# Altium schematic sheet UNG8077_EVB_7801-9031_A_1-Title.SchDoc
size 416 x 264 mm; SheetNumber: 1; PageTitle: Title; PageSetup: Record=PageOptions|CenterHorizontal=True|CenterVertical=True|PrintScale=1.02|XCorrection=1.00|YCorrection=1.00|PrintKind=0|BorderSize=5000000|LeftOffset=0|BottomOffset=0|Orientation=2|PaperLength=1000|PaperWidth=1000|Scale=100|PaperSource=7|PrintQuality=-3|MediaType=1|DitherType=10|PrintScaleMode=1|PaperKind=11 x 17|PaperIndex=119; DocumentFullPathAndName: //depot_np_hweng_boards/ung_hweng/UNG_8077_LAN7801-KSZ9031_DemoEVB/A/
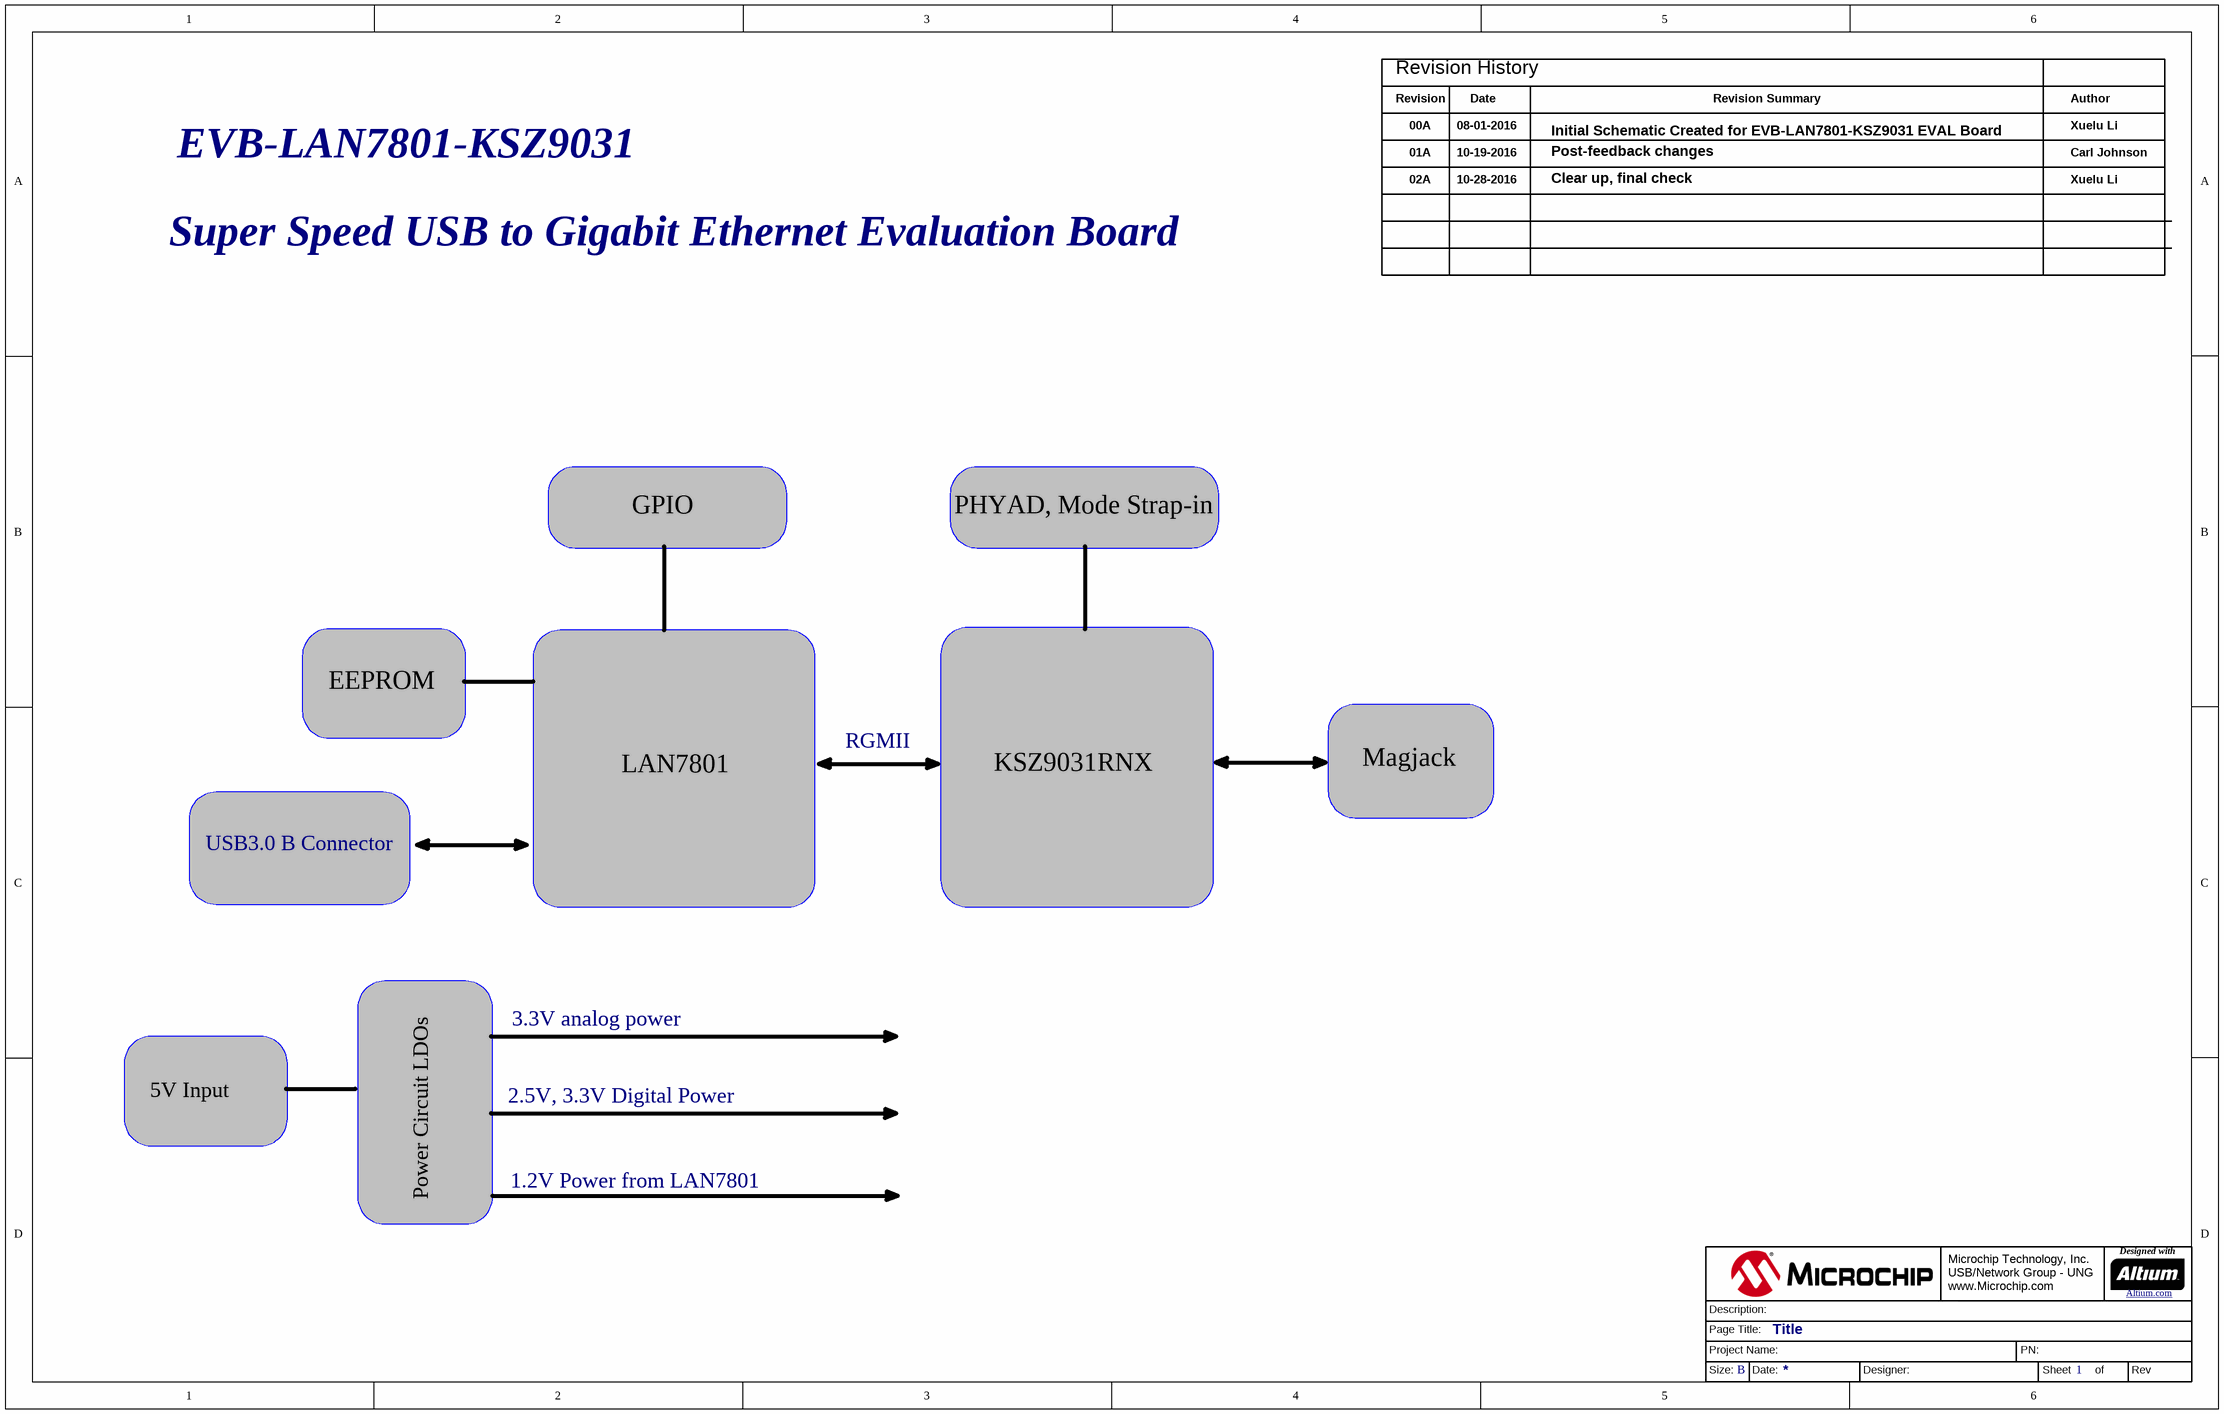
[diagram p0: UNG8077_EVB_7801-9031_A_1-Title.SchDoc]

## Parts
?  (no value)  (graphical)

## Notes on the sheet
- Revision History
- Revision
- 00A
- 08-01-2016
- Date
- Initial Schematic Created for EVB-LAN7801-KSZ9031 EVAL Board
- Revision Summary
- Author
- Xuelu Li
- EVB-LAN7801-KSZ9031
- 01A
- 02A
- 10-19-2016
- 10-28-2016
- Post-feedback changes
- Clear up, final check
- Carl Johnson
- Super Speed USB to Gigabit Ethernet Evaluation Board
- GPIO
- PHYAD, Mode Strap-in
- EEPROM
- RGMII
- LAN7801
- KSZ9031RNX
- Magjack
- USB3.0 B Connector
- 3.3V analog power
- 5V Input
- 2.5V, 3.3V Digital Power
- Power Circuit LDOs
- 1.2V Power from LAN7801
- Microchip Technology, Inc.
  USB/Network Group - UNG
  www.Microchip.com
- Designed with
- Altium.com <http://go.altium.com/MicrochipLandingPage_Evaluation.html>
- Page Title:
- Project Name:
- Description:
- PN:
- Size:
- B
- Date:
- Designer:
- Sheet
- of
- Rev

## Library data of the parts
? = Title Block B_UNG1_Altium